# Altium project moveWiFi.PrjPCB
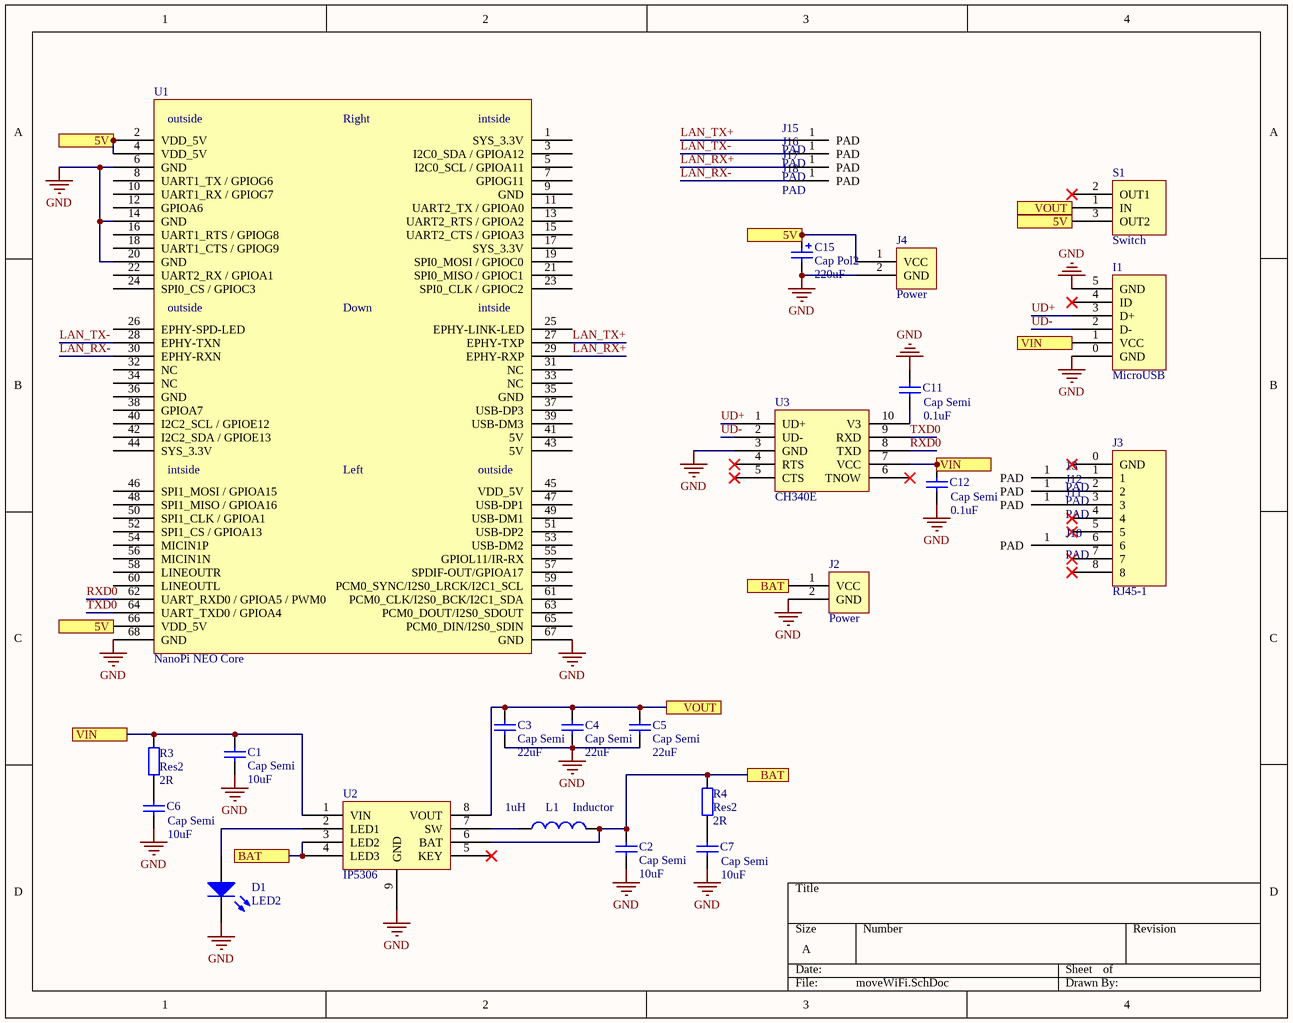
[diagram p0: moveWiFi.SchDoc]
1 sheet, 30 parts. Net scope: flat (ports and power ports of the same name join across sheets).
Board file: moveWiFi.PcbDoc

## Sheet moveWiFi.SchDoc
size A

### Parts
13  PAD  [PAD]
C1  Cap Semi  value 10uF  [C0805]
C2  Cap Semi  value 10uF  [C0805]
C3  Cap Semi  value 22uF  [C0805]
C4  Cap Semi  value 22uF  [C0805]
C5  Cap Semi  value 22uF  [C0805]
C6  Cap Semi  value 10uF  [C0805]
C7  Cap Semi  value 10uF  [C0805]
C11  Cap Semi  value 0.1uF  [C0603]
C12  Cap Semi  value 0.1uF  [C0603]
C15  Cap Pol2  value 220uF  [C7343]
D1  LED2  [R0603]
I1  MicroUSB  [MicroUSB]
J2  Power  [Power 2]
J3  RJ45-1  [RG45-3]
J4  Power  [Power 2]
J10  PAD  [PAD]
J11  PAD  [PAD]
J12  PAD  [PAD]
J15  PAD  [PAD]
J16  PAD  [PAD]
J17  PAD  [PAD]
J18  PAD  [PAD]
L1  Inductor  value 1uH  [L0630]
R3  Res2  value 2R  [R0603]
R4  Res2  value 2R  [R0603]
S1  Switch  [SwitchA]
U1  NanoPi NEO Core  [NanoPi_NEO_Core3]
U2  IP5306  [eSOP8]
U3  CH340E  [MSOP-10]

### Ports
5V, BAT, VIN, VOUT

### Nets
GND: C1.1 C2.1 C3.1 C4.1 C5.1 C6.1 C7.1 C11.2 C12.1 C15.2 D1.2(K) I1.0(GND) I1.5(GND) J2.2(GND) J4.2(GND) U1.6(GND) U1.14(GND) U1.20(GND) U1.67(GND) U1.68(GND) U2.9(GND) U3.3(GND)
LAN_RX+: J17.1(PAD) U1.29(EPHY-RXP)
LAN_RX-: J18.1(PAD) U1.30(EPHY-RXN)
LAN_TX+: J15.1(PAD) U1.27(EPHY-TXP)
LAN_TX-: J16.1(PAD) U1.28(EPHY-TXN)
RXD0: U1.62(UART_RXD0_/_GPIOA5_/_PWM0) U3.8(TXD)
TXD0: U1.64(UART_TXD0_/_GPIOA4) U3.9(RXD)
UD+: I1.3(D+) U3.1(UD+)
UD-: I1.2(D-) U3.2(UD-)
Net13_1: 13.1(PAD) J3.1
NetC1_2: C1.2 C12.2 I1.1(VCC) R3.2 U2.1(VIN) U3.7(VCC) ; port VIN
NetC2_2: C2.2 J2.1(VCC) L1.2 R4.2 U2.3(LED2) U2.4(LED3) U2.6(BAT) ; port BAT
NetC3_2: C3.2 C4.2 C5.2 S1.1(IN) U2.8(VOUT) ; port VOUT
NetC6_2: C6.2 R3.1
NetC7_2: C7.2 R4.1
NetC11_1: C11.1 U3.10(V3)
NetC15_1: C15.1 J4.1(VCC) S1.3(OUT2) U1.2(VDD_5V) U1.4(VDD_5V) U1.66(VDD_5V) ; port 5V
NetD1_1: D1.1(A) U2.2(LED1)
NetJ3_2: J3.2 J12.1(PAD)
NetJ3_3: J3.3 J11.1(PAD)
NetJ3_6: J3.6 J10.1(PAD)
NetL1_1: L1.1 U2.7(SW)

Not connected (* = marked no-connect by the designer): I1 4(ID)*; J3 0(GND)* 4* 5* 7* 8*; S1 2(OUT1)*; U1 1(SYS_3.3V) 3(I2C0_SDA_/_GPIOA12) 5(I2C0_SCL_/_GPIOA11) 7(GPIOG11) 8(UART1_TX_/_GPIOG6) 9(GND) 10(UART1_RX_/_GPIOG7) 11(UART2_TX_/_GPIOA0) 12(GPIOA6) 13(UART2_RTS_/_GPIOA2) 15(UART2_CTS_/_GPIOA3) 16(UART1_RTS_/_GPIOG8) 17(SYS_3.3V) 18(UART1_CTS_/_GPIOG9) 19(SPI0_MOSI_/_GPIOC0) 21(SPI0_MISO_/_GPIOC1) 22(UART2_RX_/_GPIOA1) 23(SPI0_CLK_/_GPIOC2) 24(SPI0_CS_/_GPIOC3) 25(EPHY-LINK-LED) 26(EPHY-SPD-LED) 31(NC) 32(NC) 33(NC) 34(NC) 35(GND) 36(GND) 37(USB-DP3) 38(GPIOA7) 39(USB-DM3) 40(I2C2_SCL_/_GPIOE12) 41(5V) 42(I2C2_SDA_/_GPIOE13) 43(5V) 44(SYS_3.3V) 45(VDD_5V) 46(SPI1_MOSI_/_GPIOA15) 47(USB-DP1) 48(SPI1_MISO_/_GPIOA16) 49(USB-DM1) 50(SPI1_CLK_/_GPIOA1) 51(USB-DP2) 52(SPI1_CS_/_GPIOA13) 53(USB-DM2) 54(MICIN1P) 55(GPIOL11/IR-RX) 56(MICIN1N) 57(SPDIF-OUT/GPIOA17) 58(LINEOUTR) 59(PCM0_SYNC/I2S0_LRCK/I2C1_SCL) 60(LINEOUTL) 61(PCM0_CLK/I2S0_BCK/I2C1_SDA) 63(PCM0_DOUT/I2S0_SDOUT) 65(PCM0_DIN/I2S0_SDIN); U2 5(KEY)*; U3 4(RTS)* 5(CTS)* 6(TNOW)*

### Notes on the sheet
- (in symbol NanoPi_NEO_Core) outside; Right; intside; Down; Left

### Library data of the parts
C1-C7 C11 C12 = Cap Semi: Capacitor (Semiconductor SIM Model); Published: 8-Jun-2000; LatestRevisionDate: 29-May-2009; LatestRevisionNote: IPC-7351 Footprint Added.; PackageReference: C1206; Publisher: Altium Limited; PackageDescription: Chip Capacitor
C15 = Cap Pol2: Polarized Capacitor (Axial); Published: 8-Jun-2000; LatestRevisionDate: 17-Jul-2002; LatestRevisionNote: Re-released for DXP Platform.; PackageReference: POLAR0.8; Publisher: Altium Limited; PackageDescription: Polarized Capacitor; 2 Leads
D1 = LED2: Typical RED, GREEN, YELLOW, AMBER GaAs LED; Published: 8-Jun-2000; LatestRevisionDate: 17-Jul-2002; LatestRevisionNote: Re-released for DXP Platform.; PackageVersion: Feb-2002; PackageReference: 3.2X1.6X1.1; Publisher: Altium Limited; PackageDescription: SM LED; 2 Flat Leads
J3 = RJ45-3
L1 = Inductor: Code_IEC: 1005; Published: 8-Jun-2000; LatestRevisionDate: 29-May-2009; LatestRevisionNote: IPC-7351 Footprint Added.; PackageReference: 0402-A; Publisher: Altium Limited; PackageDescription: Chip Inductor; Code_JEITA: 0402
R3 R4 = Res2: Resistor; Published: 8-Jun-2000; LatestRevisionDate: 17-Jul-2002; LatestRevisionNote: Re-released for DXP Platform.; PackageReference: AXIAL-0.4; Publisher: Altium Limited; PackageDescription: Axial Device, Thru-Hole; 2 Leads; 0.4 in Pin Spacing
U1 = NanoPi_NEO_Core